# EAGLE design schematic (EAGLE 9.5.2)
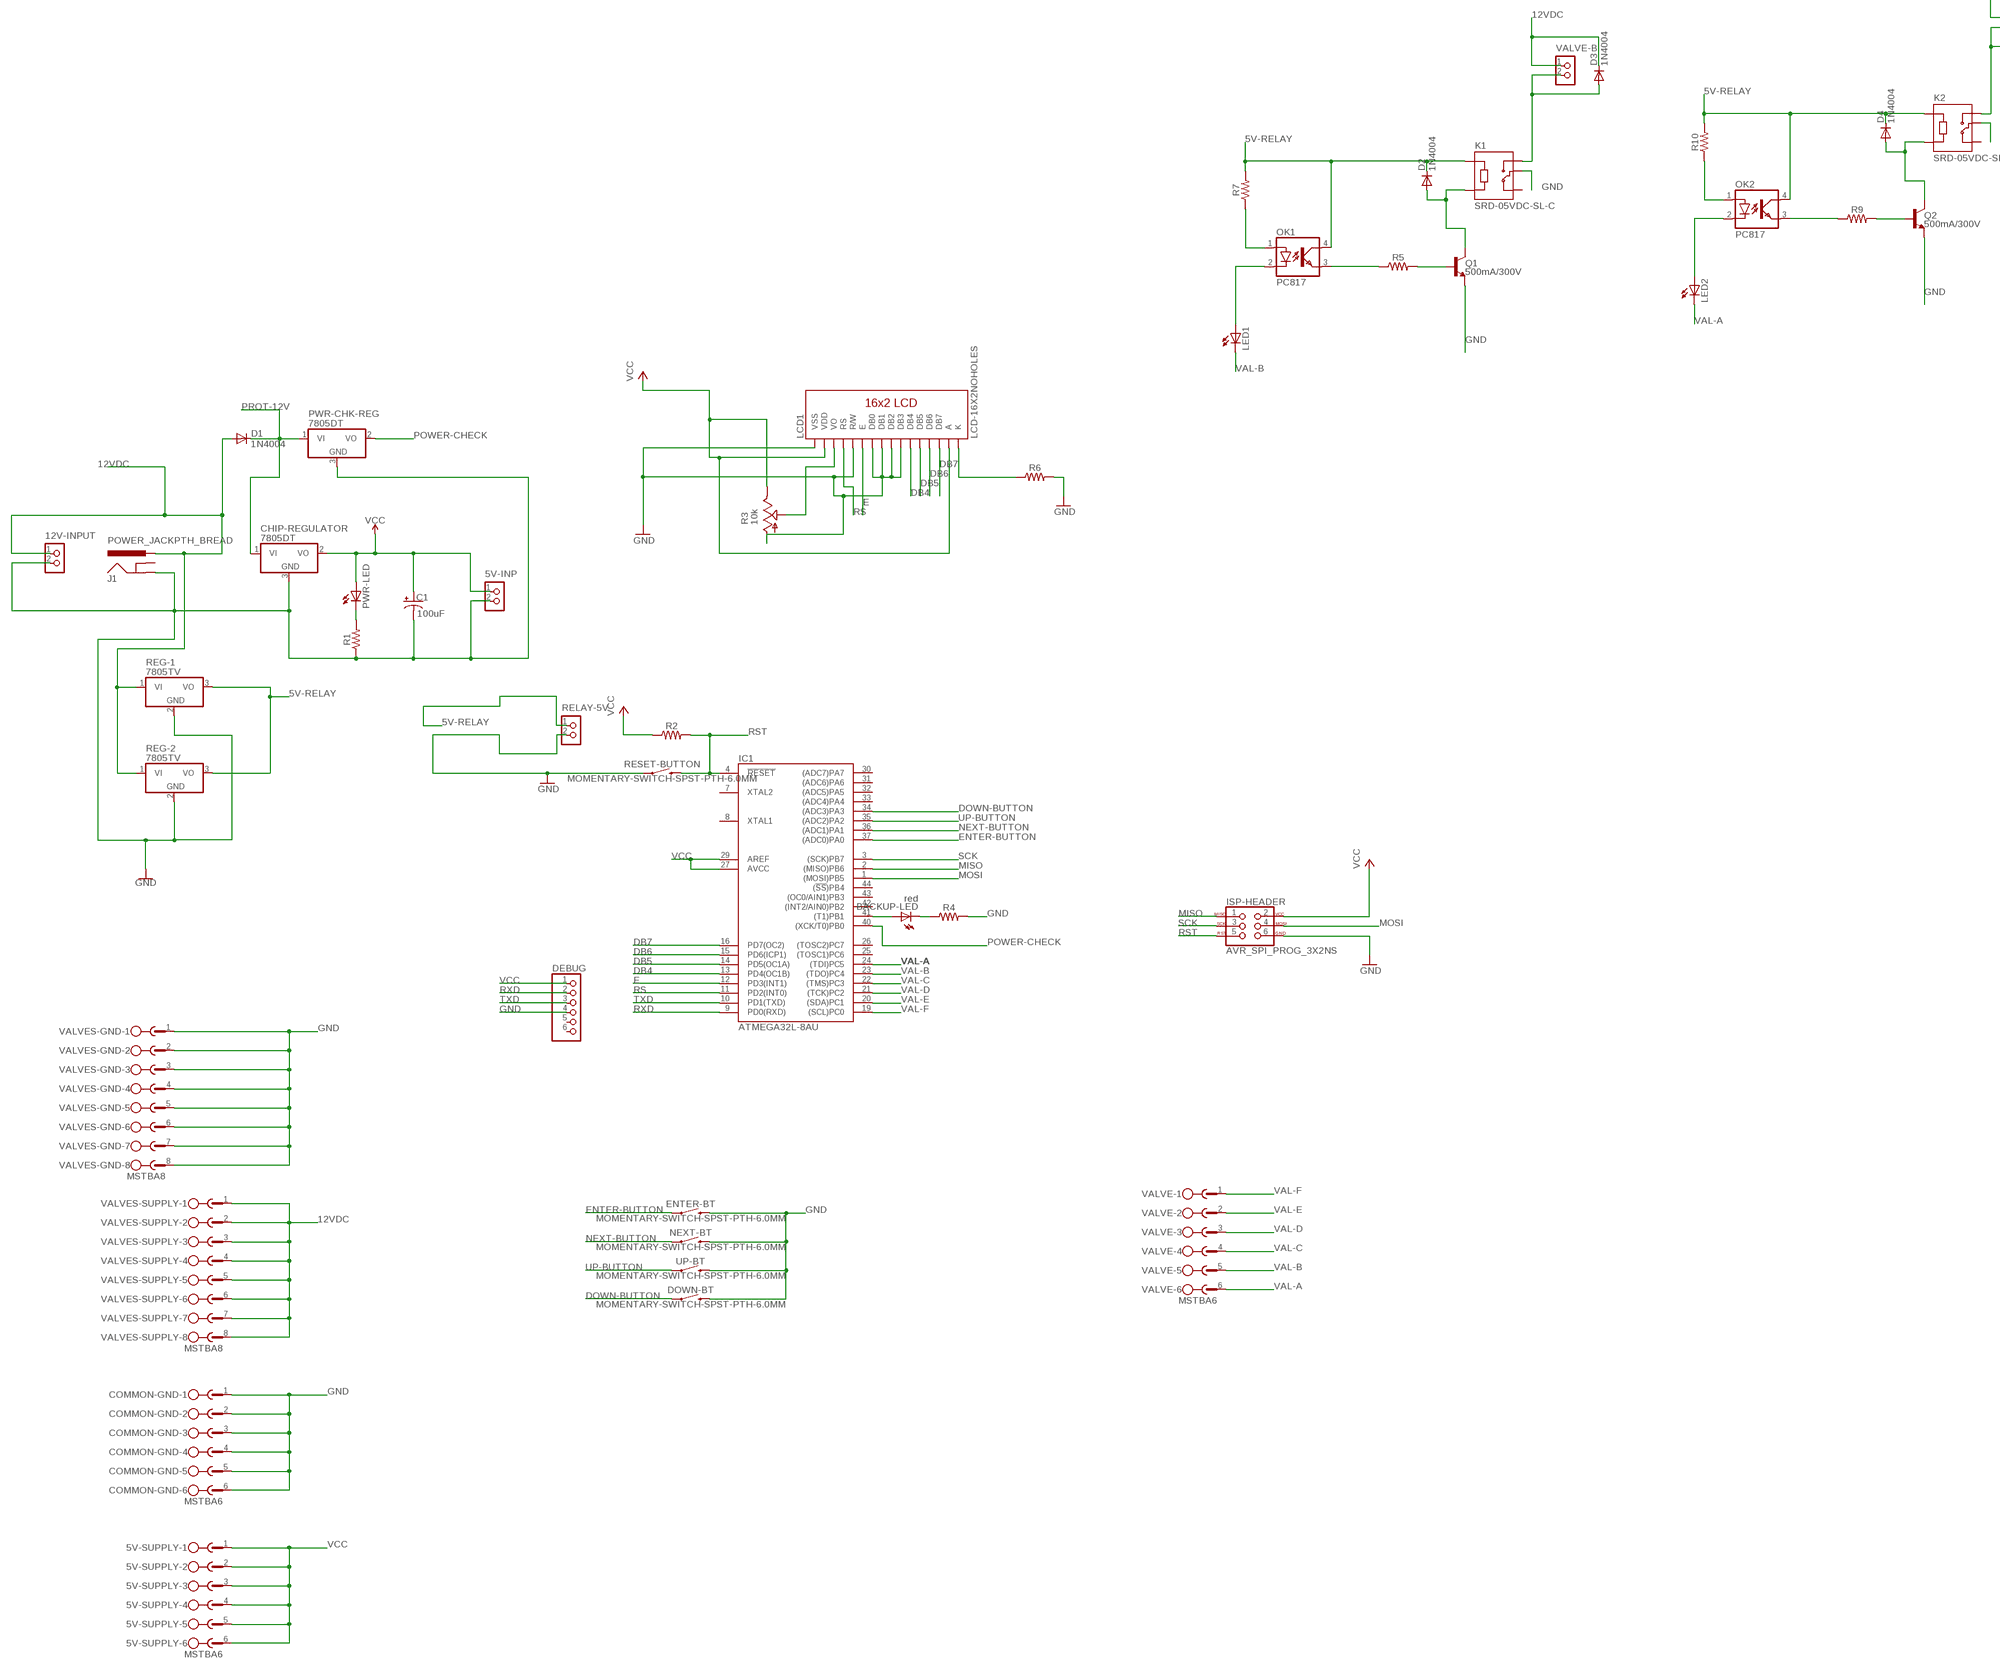
[diagram p0: schematic, sheet 1, part 1 of 2]
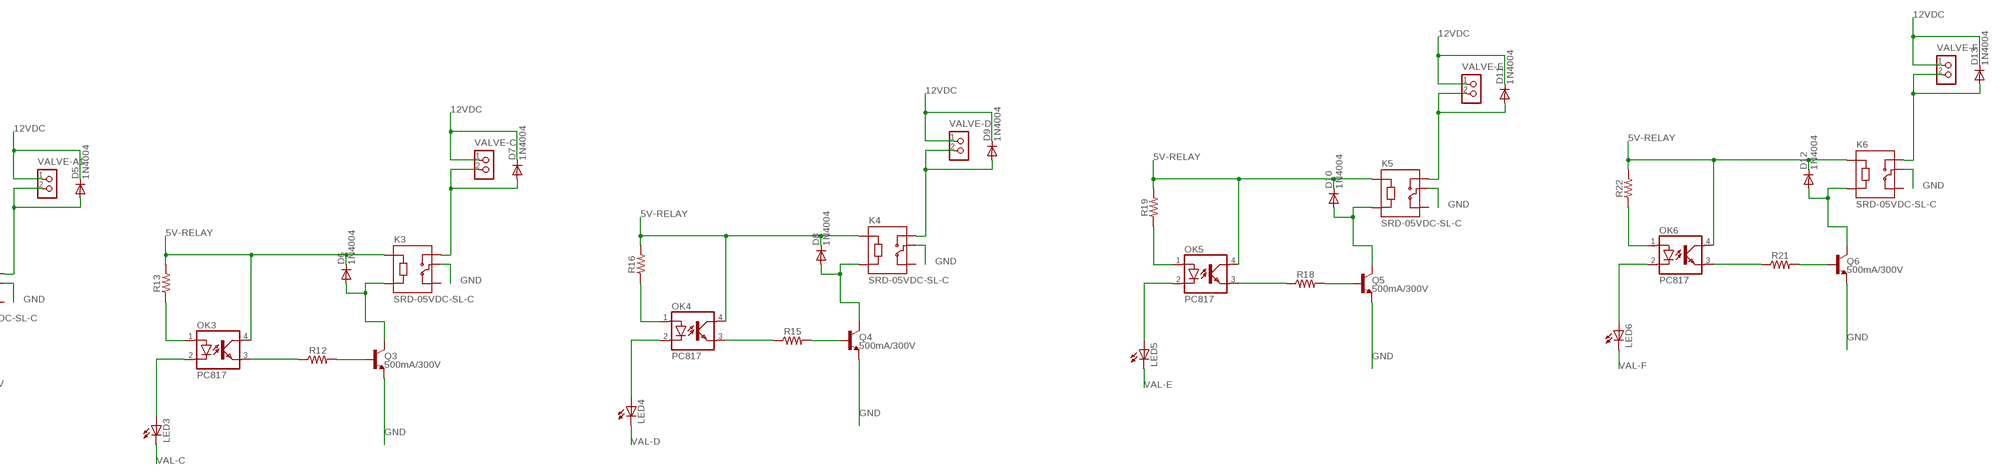
[diagram p1: schematic, sheet 1, part 2 of 2]

## Parts
5V-INP  CON_TERMINAL_BLOCK_02-5MM  [TERMINAL_BLOCK_2P_5]
5V-SUPPLY  MSTBA6  [MSTBA6]
12V-INPUT  CON_TERMINAL_BLOCK_02-5MM  [TERMINAL_BLOCK_2P_5]
BACKUP-LED  red  LED1206  [LED-1206]
C1  100uF  100UF-POLAR-RADIAL-2.5MM-25V-20%  [CPOL-RADIAL-2.5MM-6.5MM]
CHIP-REGULATOR  7805DT  [TO252]
COMMON-GND  MSTBA6  [MSTBA6]
D1  1N4004  [DO41-10]
D2  1N4004  [DO41-10]
D3  1N4004  [DO41-10]
D4  1N4004  [DO41-10]
D5  1N4004  [DO41-10]
D6  1N4004  [DO41-10]
D7  1N4004  [DO41-10]
D8  1N4004  [DO41-10]
D9  1N4004  [DO41-10]
D10  1N4004  [DO41-10]
D11  1N4004  [DO41-10]
D12  1N4004  [DO41-10]
D13  1N4004  [DO41-10]
DEBUG  PINHD-1X6B  [1X06-BIG]
DOWN-BT  MOMENTARY-SWITCH-SPST-PTH-6.0MM  [TACTILE_SWITCH_PTH_6.0MM]
ENTER-BT  MOMENTARY-SWITCH-SPST-PTH-6.0MM  [TACTILE_SWITCH_PTH_6.0MM]
IC1  ATMEGA32L-8AU  [QFP44_10X10_0.80]
ISP-HEADER  AVR_SPI_PROG_3X2NS  [2X3-NS]
J1  POWER_JACKPTH_BREAD  [POWER_JACK_PTH_BREAD]
K1  SRD-05VDC-SL-C  [RELAY_SRD-05VDC-SL-C]
K2  SRD-05VDC-SL-C  [RELAY_SRD-05VDC-SL-C]
K3  SRD-05VDC-SL-C  [RELAY_SRD-05VDC-SL-C]
K4  SRD-05VDC-SL-C  [RELAY_SRD-05VDC-SL-C]
K5  SRD-05VDC-SL-C  [RELAY_SRD-05VDC-SL-C]
K6  SRD-05VDC-SL-C  [RELAY_SRD-05VDC-SL-C]
LCD1  LCD-16X2NOHOLES  [LCD-16X2_NOHOLESNOSILK]
LED1  LED1206  [LED-1206]
LED2  LED1206  [LED-1206]
LED3  LED1206  [LED-1206]
LED4  LED1206  [LED-1206]
LED5  LED1206  [LED-1206]
LED6  LED1206  [LED-1206]
NEXT-BT  MOMENTARY-SWITCH-SPST-PTH-6.0MM  [TACTILE_SWITCH_PTH_6.0MM]
OK1  PC817  [DIL04]
OK2  PC817  [DIL04]
OK3  PC817  [DIL04]
OK4  PC817  [DIL04]
OK5  PC817  [DIL04]
OK6  PC817  [DIL04]
PWR-CHK-REG  7805DT  [TO252]
PWR-LED  LED1206  [LED-1206]
Q1  500mA/300V  TRANS_NPN-MMBTA42  [SOT23-3]
Q2  500mA/300V  TRANS_NPN-MMBTA42  [SOT23-3]
Q3  500mA/300V  TRANS_NPN-MMBTA42  [SOT23-3]
Q4  500mA/300V  TRANS_NPN-MMBTA42  [SOT23-3]
Q5  500mA/300V  TRANS_NPN-MMBTA42  [SOT23-3]
Q6  500mA/300V  TRANS_NPN-MMBTA42  [SOT23-3]
R1  RESISTOR1206  [1206]
R2  RESISTOR1206  [1206]
R3  10k  TRIM_US-CA6V  [CA6V]
R4  RESISTOR1206  [1206]
R5  RESISTOR1206  [1206]
R6  RESISTOR1206  [1206]
R7  RESISTOR1206  [1206]
R9  RESISTOR1206  [1206]
R10  RESISTOR1206  [1206]
R12  RESISTOR1206  [1206]
R13  RESISTOR1206  [1206]
R15  RESISTOR1206  [1206]
R16  RESISTOR1206  [1206]
R18  RESISTOR1206  [1206]
R19  RESISTOR1206  [1206]
R21  RESISTOR1206  [1206]
R22  RESISTOR1206  [1206]
REG-1  7805TV  [TO220V]
REG-2  7805TV  [TO220V]
RELAY-5V  CON_TERMINAL_BLOCK_02-5MM  [TERMINAL_BLOCK_2P_5]
RESET-BUTTON  MOMENTARY-SWITCH-SPST-PTH-6.0MM  [TACTILE_SWITCH_PTH_6.0MM]
UP-BT  MOMENTARY-SWITCH-SPST-PTH-6.0MM  [TACTILE_SWITCH_PTH_6.0MM]
VALVE  MSTBA6  [MSTBA6]
VALVE-A1  CON_TERMINAL_BLOCK_02-5MM  [TERMINAL_BLOCK_2P_5]
VALVE-B  CON_TERMINAL_BLOCK_02-5MM  [TERMINAL_BLOCK_2P_5]
VALVE-C  CON_TERMINAL_BLOCK_02-5MM  [TERMINAL_BLOCK_2P_5]
VALVE-D  CON_TERMINAL_BLOCK_02-5MM  [TERMINAL_BLOCK_2P_5]
VALVE-E  CON_TERMINAL_BLOCK_02-5MM  [TERMINAL_BLOCK_2P_5]
VALVE-F  CON_TERMINAL_BLOCK_02-5MM  [TERMINAL_BLOCK_2P_5]
VALVES-GND  MSTBA8  [MSTBA8]
VALVES-SUPPLY  MSTBA8  [MSTBA8]

## Nets
5V-RELAY: D2.C D4.C D6.C D8.C D10.C D12.C K1.A1 K2.A1 K3.A1 K4.A1 K5.A1 K6.A1 OK1.4(COL) OK2.4(COL) OK3.4(COL) OK4.4(COL) OK5.4(COL) OK6.4(COL) R7.2 R10.2 R13.2 R16.2 R19.2 R22.2 REG-1.3(VO) REG-2.3(VO) RELAY-5V.1
12VDC: 12V-INPUT.1 D1.A D3.C D5.C D7.C D9.C D11.C D13.C J1.PWR REG-1.1(VI) REG-2.1(VI) VALVE-A1.1 VALVE-B.1 VALVE-C.1 VALVE-D.1 VALVE-E.1 VALVE-F.1 VALVES-SUPPLY.1 VALVES-SUPPLY.2 VALVES-SUPPLY.3 VALVES-SUPPLY.4 VALVES-SUPPLY.5 VALVES-SUPPLY.6 VALVES-SUPPLY.7 VALVES-SUPPLY.8
DB4: IC1.13(PD4(OC1B)) LCD1.11(DB4)
DB5: IC1.14(PD5(OC1A)) LCD1.12(DB5)
DB6: IC1.15(PD6(ICP1)) LCD1.13(DB6)
DB7: IC1.16(PD7(OC2)) LCD1.14(DB7)
DOWN-BUTTON: DOWN-BT.1 IC1.34((ADC3)PA3)
E: IC1.12(PD3(INT1)) LCD1.6(E)
ENTER-BUTTON: ENTER-BT.1 IC1.37((ADC0)PA0)
GND: 5V-INP.2 12V-INPUT.2 C1.2(-) CHIP-REGULATOR.3(GND) COMMON-GND.1 COMMON-GND.2 COMMON-GND.3 COMMON-GND.4 COMMON-GND.5 COMMON-GND.6 DEBUG.4 DOWN-BT.3 ENTER-BT.3 ISP-HEADER.6 J1.GND K1.COM K2.COM K3.COM K4.COM K5.COM K6.COM LCD1.1(VSS) LCD1.5(R/W) LCD1.7(DB0) LCD1.8(DB1) LCD1.9(DB2) LCD1.10(DB3) NEXT-BT.3 PWR-CHK-REG.3(GND) Q1.2(E) Q2.2(E) Q3.2(E) Q4.2(E) Q5.2(E) Q6.2(E) R1.1 R3.A R4.2 R6.2 REG-1.2(GND) REG-2.2(GND) RELAY-5V.2 RESET-BUTTON.1 UP-BT.3 VALVES-GND.1 VALVES-GND.2 VALVES-GND.3 VALVES-GND.4 VALVES-GND.5 VALVES-GND.6 VALVES-GND.7 VALVES-GND.8
MISO: IC1.2((MISO)PB6) ISP-HEADER.1
MOSI: IC1.1((MOSI)PB5) ISP-HEADER.4
N$1: LCD1.16(K) R6.1
N$2: PWR-LED.C R1.2
N$3: OK1.1(A) R7.1
N$4: BACKUP-LED.A IC1.41((T1)PB1)
N$5: BACKUP-LED.C R4.1
N$6: LCD1.3(VO) R3.S
N$7: LED1.A OK1.2(C)
N$8: OK1.3(EMIT) R5.1
N$9: D2.A K1.A2 Q1.3(C)
N$10: Q1.1(B) R5.2
N$11: OK2.1(A) R10.1
N$12: D3.A K1.NO VALVE-B.2
N$13: LED2.A OK2.2(C)
N$14: OK2.3(EMIT) R9.1
N$15: Q2.1(B) R9.2
N$16: D4.A K2.A2 Q2.3(C)
N$17: D5.A K2.NO VALVE-A1.2
N$18: OK3.1(A) R13.1
N$19: LED3.A OK3.2(C)
N$20: OK3.3(EMIT) R12.1
N$21: Q3.1(B) R12.2
N$22: D6.A K3.A2 Q3.3(C)
N$23: D7.A K3.NO VALVE-C.2
N$24: OK4.1(A) R16.1
N$25: LED4.A OK4.2(C)
N$26: OK4.3(EMIT) R15.1
N$27: Q4.1(B) R15.2
N$28: D8.A K4.A2 Q4.3(C)
N$29: D9.A K4.NO VALVE-D.2
N$30: OK5.1(A) R19.1
N$31: LED5.A OK5.2(C)
N$32: OK5.3(EMIT) R18.1
N$33: Q5.1(B) R18.2
N$34: D10.A K5.A2 Q5.3(C)
N$35: D11.A K5.NO VALVE-E.2
N$36: OK6.1(A) R22.1
N$37: LED6.A OK6.2(C)
N$38: OK6.3(EMIT) R21.1
N$39: Q6.1(B) R21.2
N$40: D12.A K6.A2 Q6.3(C)
N$41: D13.A K6.NO VALVE-F.2
NEXT-BUTTON: IC1.36((ADC1)PA1) NEXT-BT.1
POWER-CHECK: IC1.40((XCK/T0)PB0) PWR-CHK-REG.2(VO)
PROT-12V: CHIP-REGULATOR.1(VI) D1.C PWR-CHK-REG.1(VI)
RS: IC1.11(PD2(INT0)) LCD1.4(RS)
RST: IC1.4(!RESET) ISP-HEADER.5 R2.2 RESET-BUTTON.3
RXD: DEBUG.2 IC1.9(PD0(RXD))
SCK: IC1.3((SCK)PB7) ISP-HEADER.3
TXD: DEBUG.3 IC1.10(PD1(TXD))
UP-BUTTON: IC1.35((ADC2)PA2) UP-BT.1
VAL-A: IC1.24((TDI)PC5) LED2.C VALVE.6
VAL-B: IC1.23((TDO)PC4) LED1.C VALVE.5
VAL-C: IC1.22((TMS)PC3) LED3.C VALVE.4
VAL-D: IC1.21((TCK)PC2) LED4.C VALVE.3
VAL-E: IC1.20((SDA)PC1) LED5.C VALVE.2
VAL-F: IC1.19((SCL)PC0) LED6.C VALVE.1
VCC: 5V-INP.1 5V-SUPPLY.1 5V-SUPPLY.2 5V-SUPPLY.3 5V-SUPPLY.4 5V-SUPPLY.5 5V-SUPPLY.6 C1.1(+) CHIP-REGULATOR.2(VO) DEBUG.1 IC1.27(AVCC) IC1.29(AREF) ISP-HEADER.2 LCD1.2(VDD) LCD1.15(A) PWR-LED.A R2.1 R3.E
Unconnected: DEBUG.5 DEBUG.6 IC1.7(XTAL2) IC1.8(XTAL1) IC1.25((TOSC1)PC6) IC1.26((TOSC2)PC7) IC1.30((ADC7)PA7) IC1.31((ADC6)PA6) IC1.32((ADC5)PA5) IC1.33((ADC4)PA4) IC1.42((INT2/AIN0)PB2) IC1.43((OC0/AIN1)PB3) IC1.44((!SS!)PB4) J1.GNDBREAK K1.NC K2.NC K3.NC K4.NC K5.NC K6.NC

## Power pins joined to a net without a drawn wire
GND: IC1.6(GND) IC1.18(GND) IC1.28(GND) IC1.39(GND)
VCC: IC1.5(VCC) IC1.17(VCC) IC1.38(VCC)

## Library data of the parts
5V-INP 12V-INPUT RELAY-5V VALVE-A1 VALVE-B VALVE-C VALVE-D VALVE-E VALVE-F = dp_devices:CON_TERMINAL_BLOCK_02: 2 poles wire to board terminal block
5V-SUPPLY COMMON-GND VALVE = con-phoenix-508:MSTBA6: PHOENIX; MF: FARNELL; MPN: 1757284; OC_FARNELL: 3705213; OC_NEWARK: 71C4165
BACKUP-LED LED1-LED6 PWR-LED = SparkFun-Retired:LED: LEDs Standard schematic elements and footprints for 5mm, 3mm, 1206, and 0603 sized LEDs. 5mm - Spark Fun Electronics SKU : Comp-SBL
C1 = SparkFun-Capacitors:100UF-POLAR: 100µF polarized capacitors A capacitor is a passive two-terminal electrical component used to store electrical energy temporarily in an electric field.; PROD_ID: CAP-08439
CHIP-REGULATOR REG-1 REG-2 = linear:78*: Positive VOLTAGE REGULATOR Source: http://cache.national.com/ds/LM/LM78L05.pdf http://www.fairchildsemi.com/ds/LM/LM7805.pdf
D1-D13 = adafruit:1N4004: DIODE General purpose 1N400x type rectifier (With bigger pads) http://www.ladyada.net/library/pcb/eaglelibrary.html
DEBUG = adafruit:PINHD-1X6: PIN HEADER
DOWN-BT ENTER-BT NEXT-BT RESET-BUTTON UP-BT = SparkFun-Switches:MOMENTARY-SWITCH-SPST: Momentary Switch (Pushbutton) - SPST Normally-open (NO) SPST momentary switches (buttons, pushbuttons). Variants PTH-12MM - 12mm square, through-hole Momentary Pushbutton Switch - 12mm Square <https://www.sparkfun.com/products/9190> (COM-09190) PTH-6.0MM, PTH-6.0MM-KIT - 6.0mm square, through-hole Mini Pushbutton Switch <https://www.sparkfun.com/products/97> (COM-00097) KIT package intended for soldering kit's - only one side of pads' copper is exposed. PTH-RIGHT-ANGLE-KIT - Right-angle, through-hole Right Angle Tactile Button <https://www.sparkfun.com/products/10791> - Used on SparkFun BigTime Watch Kit <https://www.sparkfun.com/products/11734> SMD-12MM - 12mm square, surface-mount Tactile Button - SMD (12mm) <https://www.sparkfun.com/products/12993> (COM-12993) Used on SparkFun PicoBoard <https://www.sparkfun.com/products/11888> SMD-4.5MM - 4.5mm Square Trackball Switch Used on SparkFun Blackberry Trackballer Breakout <https://www.sparkfun.com/products/13169> SMD-4.6MMX2.8MM - 4.60mm x 2.80mm, surface mount Used on SparkFun SAMD21 Mini Breakout <https://www.sparkfun.com/products/13664> SMD-5.2MM, SMD-5.2-REDUNDANT - 5.2mm square, surface-mount Mini Pushbutton Switch - SMD <https://www.sparkfun.com/products/8720> (COM-08720) Used on Arduino Pro Mini <https://www.sparkfun.com/products/11114> REDUNDANT package connects both switch circuits together SMD-6.0X3.5MM - 6.0 x 3.5mm, surface mount Momentary Reset Switch SMD <https://www.sparkfun.com/products/8229> (COM-08229) SMD-6.2MM-TALL - 6.2mm square, surface mount Tactile Button - SMD (6mm) <https://www.sparkfun.com/products/12992> Used on SparkFun Digital Sandbox <https://www.sparkfun.com/products/12651> SMD-RIGHT-ANGLE - Right-angle, surface mount Used on SparkFun Block for Intel® Edison - Arduino <https://www.sparkfun.com/products/13036>; PROD_ID: SWCH-08441; SF_SKU: COM-00097
IC1 = atmel:ATMEGA32: 8-bit AVR Microcontroller 32 Kbytes FLASH 2 Kbytes SRAM 1 Kbytes EEPROM USART 8-channel 10 bit ADC
ISP-HEADER = SparkFun-Connectors:AVR_SPI_PROG_3X2: AVR ISP 6 Pin This is the reduced ISP connector for AVR programming. Common on Arduino. This footprint will take up less PCB space and can be used with a 10-pin to 6-pin adapter such as SKU: BOB-08508 **Special note about "TEST_POINT" package. The stop mask is on the top side, so if you want your programming test points to be on the bottom of your board, make sure to place this package on the bottom side of the board. This also ensure that the orientation to program from the bottom side will be correct. SparkFun Products: SparkFun ISP Pogo Adapter <https://www.sparkfun.com/products/11591> - NS Tiny AVR Programmer <https://www.sparkfun.com/products/11801> -PTH
J1 = SparkFun-Connectors:POWER_JACK: Power Jack Connector This is the standard 5.5mm barrel jack for power. The PTH is the most common, proven, reliable, footprint. The Slot footprint only works if the mill layer is transmitted to the PCB fab house so be warned. Here are the connectors we sell at SparkFun: DC Barrel Power Jack/Connector <https://www.sparkfun.com/products/119> (PRT-00119) DC Barrel Power Jack/Connector (SMD) <https://www.sparkfun.com/products/12748> (PRT-12748) DC Barrel Jack Adapter - Breadboard Compatible <https://www.sparkfun.com/products/10811> (PRT-10811) It is used on this SparkFun product (and many, many others): SparkFun RedBoard - Programmed with Arduino <https://www.sparkfun.com/products/12757> (DEV-12757) Also, if you need a mating power supply or connector, please check these out: Wall Adapter Power Supply - 9VDC 650mA <https://www.sparkfun.com/products/298> (TOL-00298) DC Barrel Jack Adapter - Male <https://www.sparkfun.com/products/10287> (PRT-10287); PROD_ID: PRT-10811
K1-K5 = SRD-05VDC-SL-C:SRD-05VDC-SL-C: 5V Trigger Relay Module For Arduino And Raspberry Pi 5V Trigger Relay Module For Arduino And Raspberry Pi; AVAILABILITY: Unavailable; DESCRIPTION: 5V Trigger Relay Module For Arduino And Raspberry Pi 5V Trigger Relay Module For Arduino And Raspberry Pi; MF: Songle Relay; MP: SRD-05VDC-SL-C; PACKAGE: None; PRICE: None
K6 = SRD-05VDC-SL-C:SRD-05VDC-SL-C: 5V Trigger Relay Module For Arduino And Raspberry Pi 5V Trigger Relay Module For Arduino And Raspberry Pi; AVAILABILITY: Unavailable; DESCRIPTION: 5V Trigger Relay Module For Arduino And Raspberry Pi 5V Trigger Relay Module For Arduino And Raspberry Pi; MF: Songle Relay; MP: SRD-05VDC-SL-C; PACKAGE: None; PRICE: None; SPICEPREFIX: X
LCD1 = SparkFun-Displays:LCD-16X2: Standard text-only 16x2 parallel input LCD Basic 16 character by 2 line display. Typically utilizes the extremely common HD44780 parallel interface chipset SparkFun Products: Basic 16x2 Green <https://www.sparkfun.com/products/255> Basic 8x2 Green <https://www.sparkfun.com/products/11122>; SF_ID: LCD-00255
OK1 OK3-OK6 = optocoupler:PC817: SHARP OPTO COUPLER; MPN: PC817X4J000F; OC_FARNELL: 9707727; OC_NEWARK: 97K7059
OK2 = optocoupler:PC817: SHARP OPTO COUPLER; MPN: PC817X4J000F; OC_FARNELL: 9707727; OC_NEWARK: 97K7059; SPICEPREFIX: O
PWR-CHK-REG = adafruit:78*: Positive VOLTAGE REGULATOR Added bigger pads to the TO-92 package
Q1-Q6 = SparkFun-DiscreteSemi:TRANS_NPN: NPN transistor Current controlled devices typically used to amplify current or used as a switch. BC547 - COM-08928 <http://www.sparkfun.com/products/8928> (TO-92 45V 100mA) (1.Collector 2.Base 3.Emitter) 2N3904 - COM-00521 <http://www.sparkfun.com/products/521> (TO-92 40V 200mA) (1.Emitter 2.Base 3.Collector) P2N2222A - COM-12852 <http://www.sparkfun.com/products/12852> (TO-92 40V 600mA) (1.Collector 2.Base 3.Emitter); PROD_ID: TRANS-09116
R1 = SparkFun-Resistors:RESISTOR: Generic Resistor Package; PROD_ID: 330ohms
R2 R4-R7 R9 R10 R12 R13 R15 R16 R18 R19 R21 R22 = SparkFun-Resistors:RESISTOR: Generic Resistor Package
R3 = pot:TRIM_US-: POTENTIOMETER
VALVES-GND = con-phoenix-508:MSTBA8: PHOENIX; MF: FARNELL; MPN: 1757307; OC_FARNELL: 3705225; OC_NEWARK: 71C4166
VALVES-SUPPLY = con-phoenix-508:MSTBA8: PHOENIX; MF: FARNELL; MPN: 1757307; OC_FARNELL: 3705225; OC_NEWARK: 71C4166; SPICEPREFIX: X

## Board
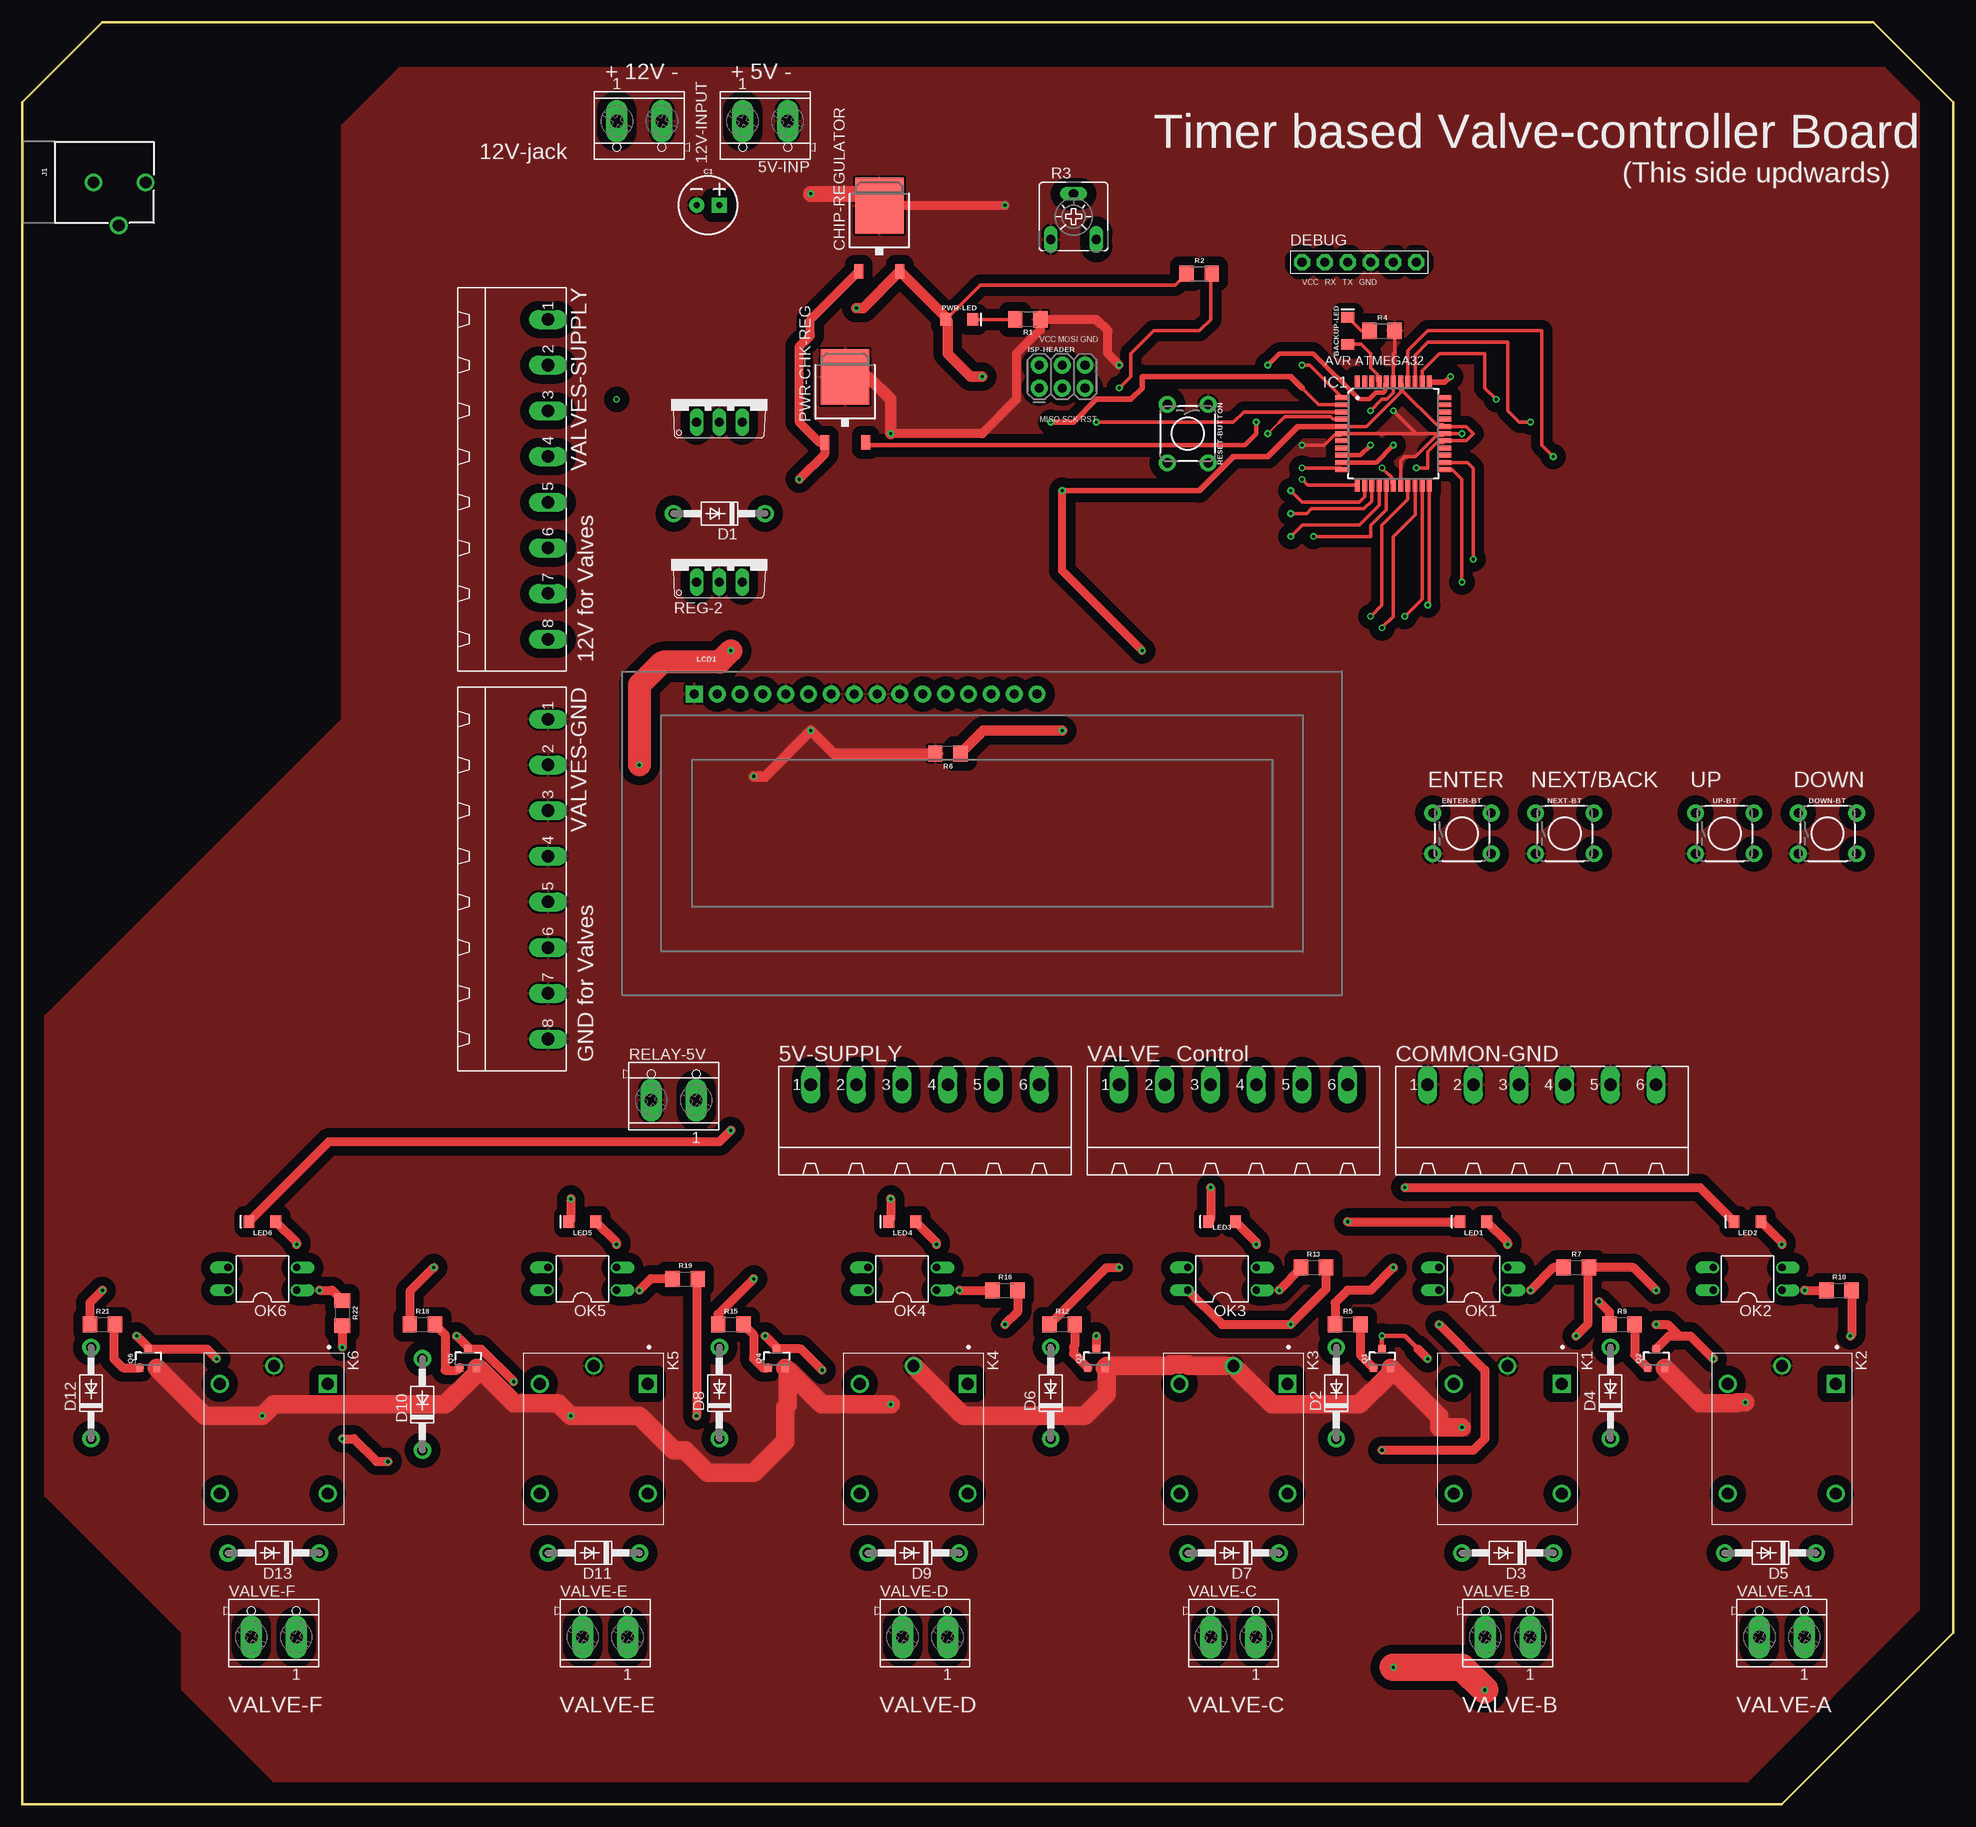
[diagram p2: board, top side]
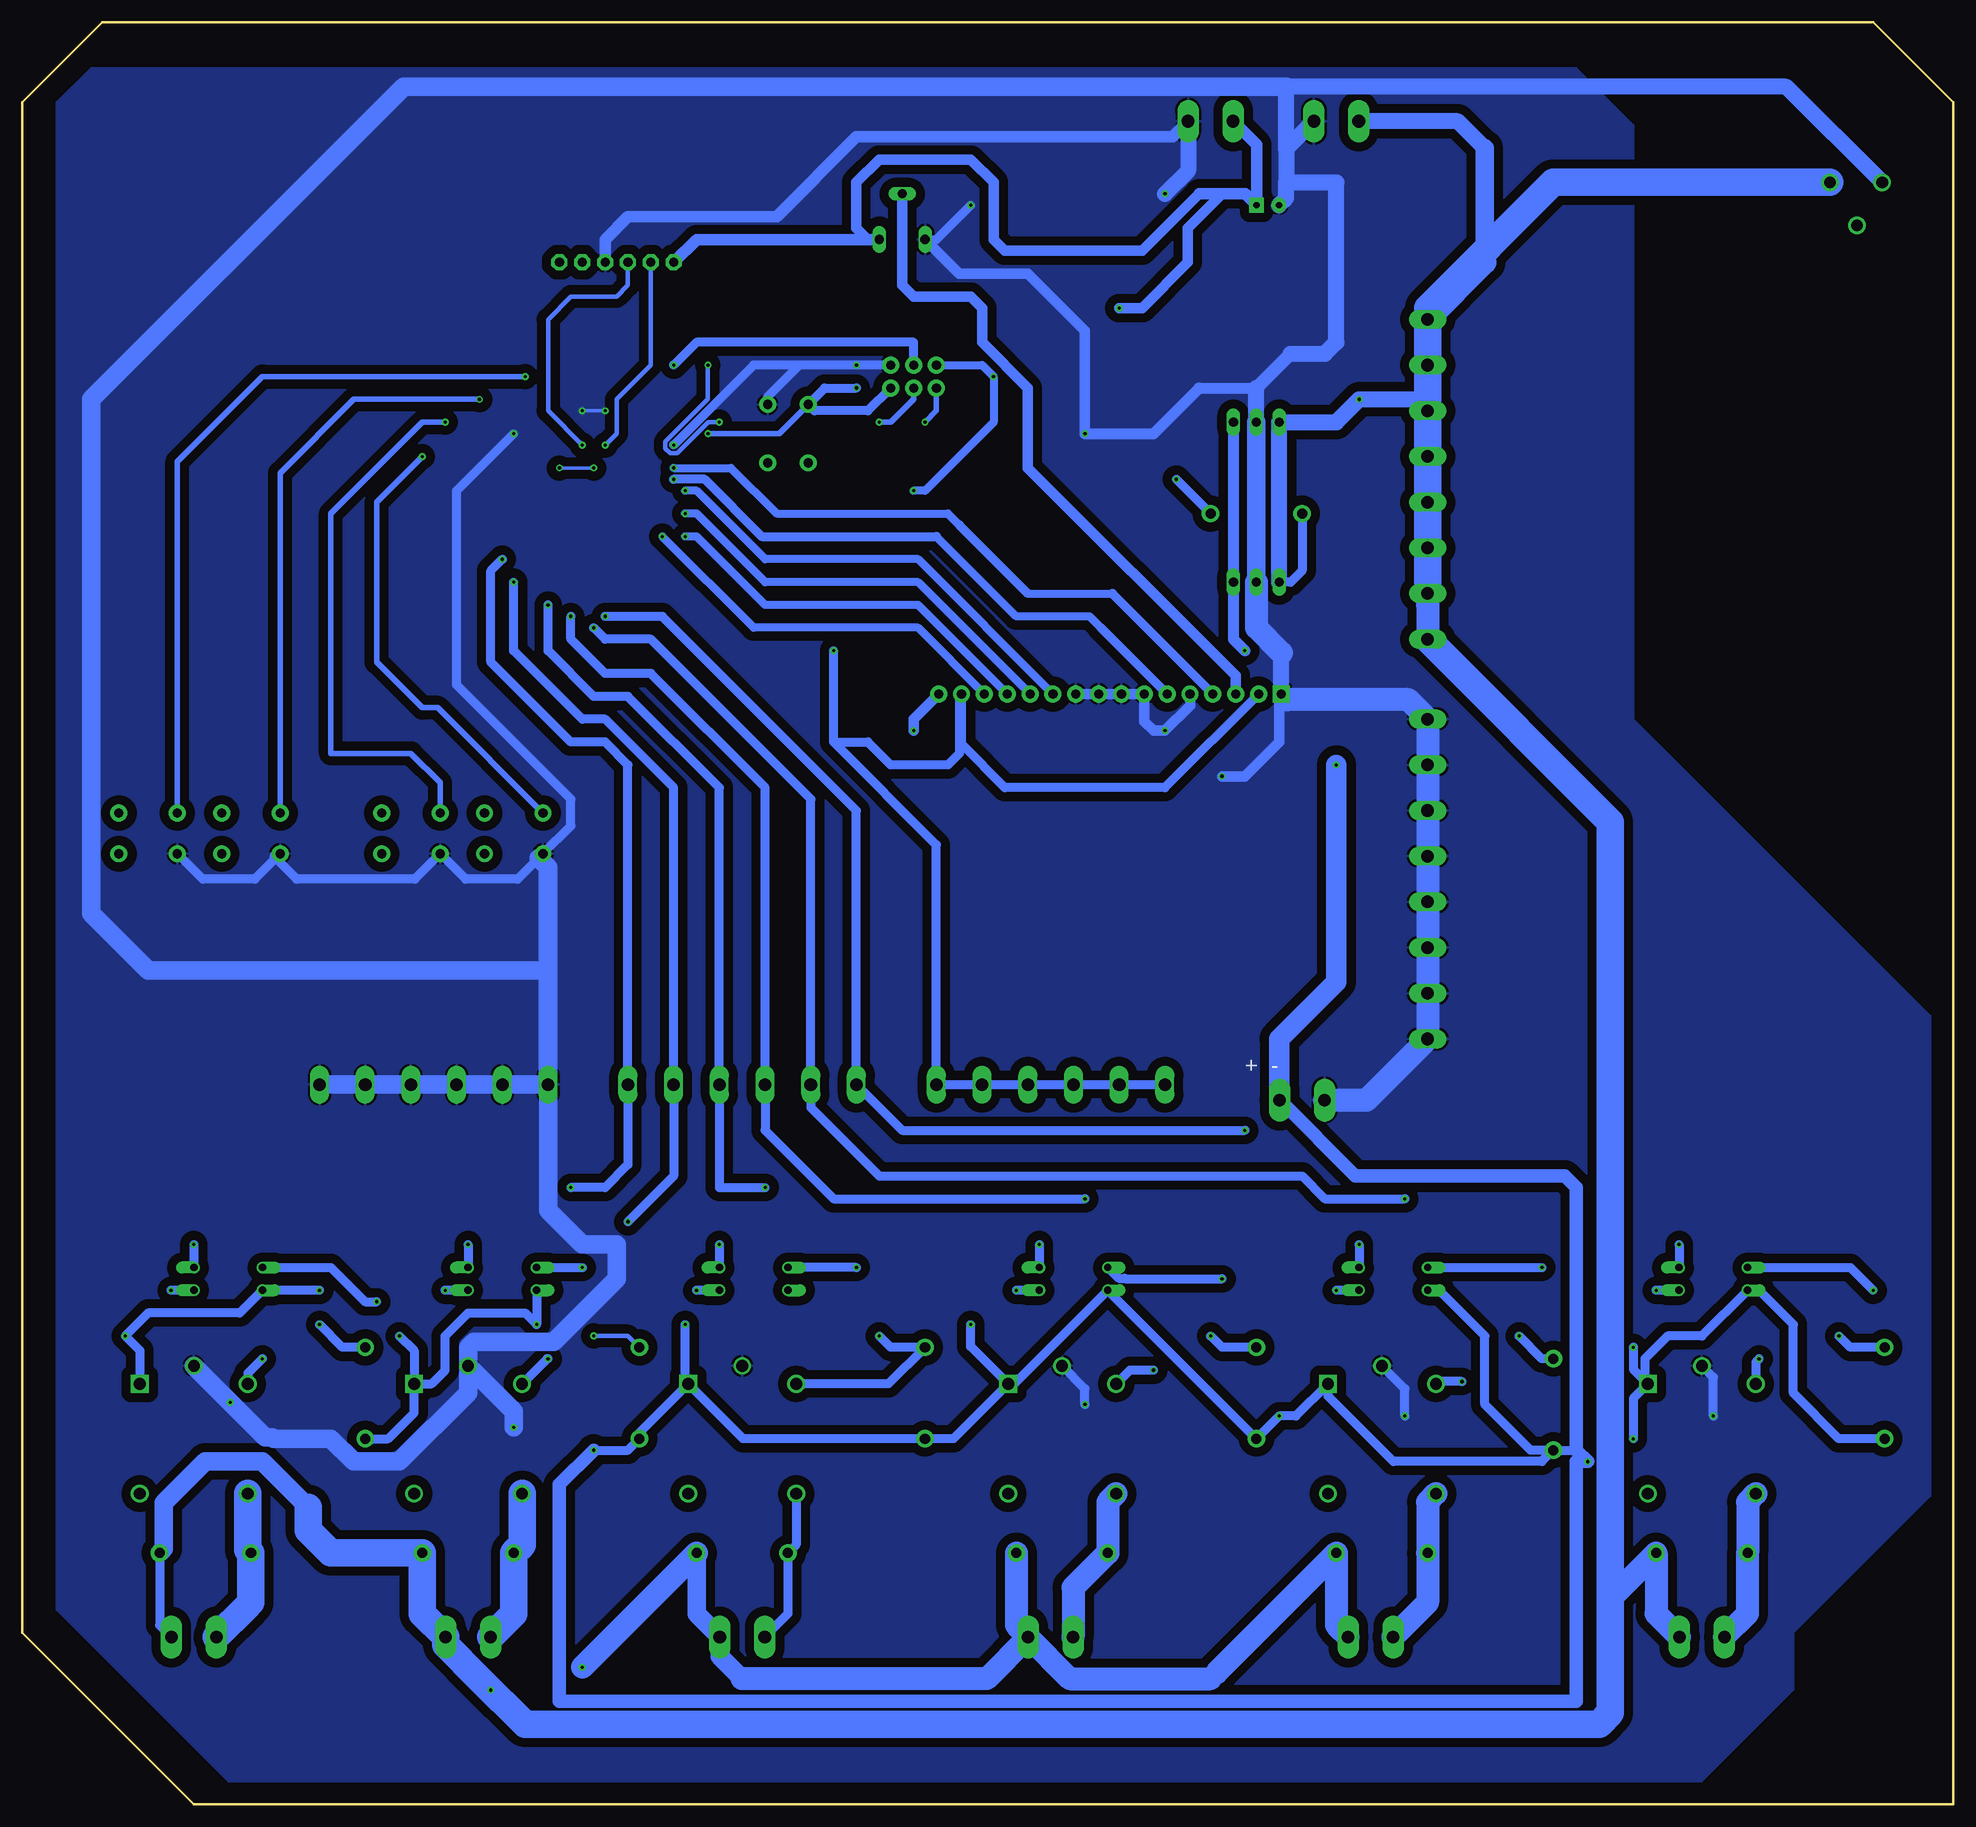
[diagram p3: board, bottom side, seen from below]

Size 214.63 x 198.12 mm. Coordinates in mm from the lower left corner, seen from the top.
Outline: 205.74,198.12 214.63,189.23 214.63,19.05 195.58,0 0,0 0,189.23 8.89,198.12 205.74,198.12
Copper layers (1*16): Top 0.035mm / dielectric 1.5mm / Bottom 0.035mm
Design rules "default": minimum track width 6mil, minimum drill 0.35mm, track to track 6mil, track to pad 6mil, pad to pad 6mil, via to via 6mil, smd to smd 6mil, copper to edge 40mil, drill to drill 6mil, minimum pad ring 10mil, minimum via ring 8mil, stop-mask expansion 4mil, vias tented up to drill 0mil, thermal gap 10mil

### Footprints (pad centres in the part's own frame; a part is rotated, then mirrored left to right if it is on the bottom)
TERMINAL_BLOCK_2P_5 = drill 1.4 pad 2.38 long: 1 2.5,-0.45; 2 -2.5,-0.45
MSTBA6 = drill 1.397 long: 1 -12.7,5.08; 2 -7.62,5.08; 3 -2.54,5.08; 4 2.54,5.08; 5 7.62,5.08; 6 12.7,5.08
LED-1206 = smd 1.2 x 1.4: A -1.5,0; C 1.5,0
CPOL-RADIAL-2.5MM-6.5MM = drill 0.7 pad 1.651 square: 1 1.25,0 | drill 0.7 pad 1.651: 2 -1.25,0
TO252 = smd 1 x 1.6: 1 -2.28,-4.8; 2 2.28,-4.8 | smd 5.4 x 6.2: 3 0,2.5
DO41-10 = drill 1.118 pad 1.93: A 5.08,0; C -5.08,0
1X06-BIG = drill 1.016 pad 1.778 octagon: 1 -6.35,0; 2 -3.81,0; 3 -1.27,0; 4 1.27,0; 5 3.81,0; 6 6.35,0
TACTILE_SWITCH_PTH_6.0MM = drill 1.016 pad 1.88: 1 -3.251,2.261; 2 3.251,2.261; 3 -3.251,-2.261; 4 3.251,-2.261
QFP44_10X10_0.80 = smd 1.5 x 0.55: 1 -5.7,4; 2 -5.7,3.2; 3 -5.7,2.4; 4 -5.7,1.6; 5 -5.7,0.8; 6 -5.7,0; 7 -5.7,-0.8; 8 -5.7,-1.6; 9 -5.7,-2.4; 10 -5.7,-3.2; 11 -5.7,-4; 23 5.7,-4; 24 5.7,-3.2; 25 5.7,-2.4; 26 5.7,-1.6; 27 5.7,-0.8; 28 5.7,0; 29 5.7,0.8; 30 5.7,1.6; 31 5.7,2.4; 32 5.7,3.2; 33 5.7,4 | smd 0.55 x 1.5: 12 -4,-5.7; 13 -3.2,-5.7; 14 -2.4,-5.7; 15 -1.6,-5.7; 16 -0.8,-5.7; 17 0,-5.7; 18 0.8,-5.7; 19 1.6,-5.7; 20 2.4,-5.7; 21 3.2,-5.7; 22 4,-5.7; 34 4,5.7; 35 3.2,5.7; 36 2.4,5.7; 37 1.6,5.7; 38 0.8,5.7; 39 0,5.7; 40 -0.8,5.7; 41 -1.6,5.7; 42 -2.4,5.7; 43 -3.2,5.7; 44 -4,5.7
2X3-NS = drill 1.016 pad 1.88: 1 -2.54,-1.27; 2 -2.54,1.27; 3 0,-1.27; 4 0,1.27; 5 2.54,-1.27; 6 2.54,1.27
POWER_JACK_PTH_BREAD = drill 1.3: GND 0,7.9; GNDBREAK 4.8,10.7; PWR 0,13.7
RELAY_SRD-05VDC-SL-C = drill 1.32 square: A1 -6.1,6 | drill 1.32: A2 -6.1,-6; NC 6.1,6; NO 6.1,-6 | drill 1.29: COM -8.1,0
LCD-16X2_NOHOLESNOSILK = drill 1.016 pad 1.88 square: 1 -32,15.5 | drill 1.016 pad 1.88: 2 -29.46,15.5; 3 -26.92,15.5; 4 -24.38,15.5; 5 -21.84,15.5; 6 -19.3,15.5; 7 -16.76,15.5; 8 -14.22,15.5; 9 -11.68,15.5; 10 -9.14,15.5; 11 -6.6,15.5; 12 -4.06,15.5; 13 -1.52,15.5; 14 1.02,15.5; 15 3.56,15.5; 16 6.1,15.5
DIL04 = drill 0.813 offset: 1 -1.27,-3.81; 2 1.27,-3.81; 3 1.27,3.81; 4 -1.27,3.81
SOT23-3 = smd 0.8 x 0.9: 1 -0.95,-1; 2 0.95,-1; 3 0,1.1
1206 = smd 1.6 x 1.8: 1 -1.4,0; 2 1.4,0
CA6V = drill 1.016 long: A -2.54,-2.54; E 2.54,-2.54; S 0,2.54
TO220V = drill 1.016 long: 1 -2.54,-2.54; 2 0,-2.54; 3 2.54,-2.54
MSTBA8 = drill 1.397 long: 1 -17.78,5.08; 2 -12.7,5.08; 3 -7.62,5.08; 4 -2.54,5.08; 5 2.54,5.08; 6 7.62,5.08; 7 12.7,5.08; 8 17.78,5.08

### Placement (x,y rotation side)
5V-INP  82.55,186.69 180 top
5V-SUPPLY  100.33,74.93 0 top
12V-INPUT  68.58,186.69 180 top
BACKUP-LED  147.32,163.83 90 top
C1  76.2,177.8 0 top
CHIP-REGULATOR  95.25,175.26 0 top
COMMON-GND  168.91,74.93 0 top
D1  77.47,143.51 180 top
D2  146.05,45.72 90 top
D3  165.1,27.94 180 top
D4  176.53,45.72 90 top
D5  194.31,27.94 180 top
D6  114.3,45.72 90 top
D7  134.62,27.94 180 top
D8  77.47,45.72 90 top
D9  99.06,27.94 180 top
D10  44.45,44.45 90 top
D11  63.5,27.94 180 top
D12  7.62,45.72 90 top
D13  27.94,27.94 180 top
DEBUG  148.59,171.45 0 top
DOWN-BT  200.66,107.95 0 top
ENTER-BT  160.02,107.95 0 top
IC1  152.4,152.4 0 top
ISP-HEADER  115.57,158.75 0 top
J1  0,180.34 270 top
K1  165.1,40.64 270 top
K2  195.58,40.64 270 top
K3  134.62,40.64 270 top
K4  99.06,40.64 270 top
K5  63.5,40.64 270 top
K6  27.94,40.64 270 top
LCD1  106.68,107.95 0 top
LED1  161.29,64.77 180 top
LED2  191.77,64.77 180 top
LED3  133.35,64.77 180 top
LED4  97.79,64.77 180 top
LED5  62.23,64.77 180 top
LED6  26.67,64.77 180 top
NEXT-BT  171.45,107.95 0 top
OK1  161.29,58.42 90 top
OK2  191.77,58.42 90 top
OK3  133.35,58.42 90 top
OK4  97.79,58.42 90 top
OK5  62.23,58.42 90 top
OK6  26.67,58.42 90 top
PWR-CHK-REG  91.44,156.21 0 top
PWR-LED  104.14,165.1 0 top
Q1  151.13,49.53 0 top
Q2  181.61,49.53 0 top
Q3  119.38,49.53 0 top
Q4  83.82,49.53 0 top
Q5  49.53,49.53 0 top
Q6  13.97,49.53 0 top
R1  111.76,165.1 180 top
R2  130.81,170.18 0 top
R3  116.84,176.53 0 top
R4  151.13,163.83 0 top
R5  147.32,53.34 0 top
R6  102.87,116.84 180 top
R7  172.72,59.69 0 top
R9  177.8,53.34 0 top
R10  201.93,57.15 0 top
R12  115.57,53.34 0 top
R13  143.51,59.69 0 top
R15  78.74,53.34 0 top
R16  109.22,57.15 0 top
R18  44.45,53.34 0 top
R19  73.66,58.42 0 top
R21  8.89,53.34 0 top
R22  35.56,54.61 270 top
REG-1  77.47,156.21 0 top
REG-2  77.47,138.43 0 top
RELAY-5V  72.39,78.74 0 top
RESET-BUTTON  129.54,152.4 270 top
UP-BT  189.23,107.95 0 top
VALVE  134.62,74.93 0 top
VALVE-A1  195.58,19.05 0 top
VALVE-B  165.1,19.05 0 top
VALVE-C  134.62,19.05 0 top
VALVE-D  100.33,19.05 0 top
VALVE-E  64.77,19.05 0 top
VALVE-F  27.94,19.05 0 top
VALVES-GND  53.34,102.87 270 top
VALVES-SUPPLY  53.34,147.32 270 top

### Tracks (layer width: path | path; a pad name or v marks a point on that pad's centre or on a via)
5V-RELAY  (via drill 0.35)
  Top 1.016: v157.48,53.34 162.56,48.26 162.56,40.64 161.29,39.37 v151.13,39.37 | R10.2 203.33,52.2 v203.2,52.07 | v181.61,57.15 179.07,59.69 R7.2 173.99,59.56 173.99,53.34 v172.72,52.07 | R13.2 144.91,57.28 v140.97,53.34 133.35,53.34 OK3.4 | R19.2 74.93,58.29 v74.93,43.18 | v35.56,40.64 36.83,40.64 39.37,38.1 v40.64,38.1 | R16.2 110.62,54.74 v109.22,53.34 | R22.2 v35.56,50.8
  Top 2.54: v78.74,128.27 77.47,127 71.12,127 68.58,124.46 v68.58,115.57
  Bottom 1.016: v172.72,52.07 171.1,50.45 K1.A1 | OK1.4 v157.48,53.34 158.75,54.61 165.1,54.61 167.64,52.07 167.64,48.26 169.16,46.74 K1.A1 | v151.13,39.37 147.32,39.37 D2.C 146.05,41.31 K3.A1 | K2.A1 201.58,50.45 v203.2,52.07 200.66,54.61 190.5,54.61 OK2.4 v181.61,57.15 | D4.C 173.99,40.64 171.1,43.53 K1.A1 | K3.A1 134.52,40.64 D6.C 111.16,40.64 K4.A1 | K3.A1 140.97,47.09 v140.97,53.34 | K4.A1 104.39,46.74 OK4.4 D8.C v74.93,43.18 73.06,43.18 K5.A1 69.5,45.37 62.23,38.1 45.72,38.1 D10.C | K4.A1 109.22,50.9 v109.22,53.34 | D10.C 46.99,39.37 52.07,44.45 52.07,52.07 57.15,57.15 OK5.4 | 34.29,47.09 K6.A1 35.56,45.12 v35.56,40.64 | 34.29,47.09 34.29,49.53 31.75,52.07 27.94,52.07 OK6.4 21.59,57.15 17.78,53.34 17.78,45.72 12.7,40.64 D12.C | D10.C 41.91,39.37 | v35.56,50.8 35.56,48.36 34.29,47.09
  Bottom 1.245: REG-1.3 REG-2.3 80.01,129.54 v78.74,128.27
  Bottom 1.524: RELAY-5V.1 66.45,69.85 43.18,69.85 41.91,68.58 41.91,39.37 v40.64,38.1 41.91,38.1 41.91,11.43 154.94,11.43 154.94,35.56 v151.13,39.37
  Bottom 2.286: RELAY-5V.1 74.93,78.33 74.93,85.09 68.58,91.44 v68.58,115.57
12VDC  (via drill 0.35)
  Top 3.048: v152.4,15.24 160.02,15.24 v162.56,12.7
  Bottom 1.016: 58.42,133.35 VALVES-SUPPLY.8 | D1.A 72.39,137.16 73.66,135.89 REG-2.1 | D5.C 199.39,19.91 VALVE-A1.1 | 81.91,14.61 82.55,13.97
  Bottom 1.778: REG-2.1 REG-1.1 68.58,153.67 v66.04,156.21 58.42,156.21 | 52.07,184.15 55.06,187.14 12V-INPUT.1
  Bottom 2.032: 52.07,184.15 52.07,171.45 | D5.C 198.91,28.42 198.91,33.5 194.31,38.1 187.96,38.1 182.88,33.02 | 134.62,13.97 137.12,16.47 VALVE-C.1 139.7,21.18 D7.C
  Bottom 2.54: VALVES-SUPPLY.1 52.07,171.45 | 58.42,156.21 VALVES-SUPPLY.3 | 58.42,133.35 VALVES-SUPPLY.7 VALVES-SUPPLY.8 | v152.4,15.24 D7.C | VALVE-D.1 107.46,13.97 134.62,13.97 | D9.C 104.14,19.91 VALVE-D.1 | VALVE-D.1 98.2,13.97 82.55,13.97 | 81.91,14.61 D11.C 68.58,19.91 VALVE-E.1 | 38.1,22.86 D13.C 33.02,21.18 VALVE-F.1 | v162.56,12.7 163.83,13.97
  Bottom 3.048: 58.42,156.21 VALVES-SUPPLY.2 VALVES-SUPPLY.1 58.42,166.37 44.45,180.34 J1.PWR | VALVES-SUPPLY.3 VALVES-SUPPLY.4 VALVES-SUPPLY.5 VALVES-SUPPLY.6 VALVES-SUPPLY.7 | VALVES-SUPPLY.8 38.1,109.22 38.1,22.86 38.1,10.16 39.37,8.89 158.75,8.89 163.83,13.97 167.6,17.74 VALVE-B.1 170.18,21.18 D3.C 180.34,27.94 182.88,30.48 182.88,33.02
DB4  (via drill 0.35)
  Top 0.381: v140.97,146.05 142.24,144.78 148.59,144.78 149.2,145.39 IC1.13
  Bottom 0.889: LCD1.11 115.06,138.43 132.08,138.43 139.7,146.05 v140.97,146.05
DB5  (via drill 0.35)
  Top 0.381: v140.97,143.51 142.76,143.51 143.29,144.04 149.12,144.04 150,144.92 IC1.14
  Bottom 0.889: LCD1.12 115.06,135.89 132.08,135.89 139.7,143.51 v140.97,143.51
DB6  (via drill 0.35)
  Top 0.381: IC1.15 150.8,144.45 148.59,142.24 142.24,142.24 v140.97,140.97
  Bottom 0.889: LCD1.13 115.06,133.35 132.08,133.35 139.7,140.97 v140.97,140.97
DB7  (via drill 0.35)
  Top 0.381: v143.51,140.97 149.86,140.97 149.86,142.24 151.6,143.98 IC1.16
  Bottom 0.889: LCD1.14 115.06,130.81 133.35,130.81 v143.51,140.97
DOWN-BUTTON  (via drill 0.35)
  Top 0.635: v158.75,158.75 158.1,158.1 IC1.34
  Bottom 0.635: DOWN-BT.1 197.41,149.3 187.96,158.75 v158.75,158.75
E  (via drill 0.35)
  Top 0.381: IC1.12 142.86,146.7 v142.24,147.32
  Bottom 0.889: 113.03,140.97 104.14,132.08 96.01,132.08 94.74,130.81
  Bottom 1.016: LCD1.6 94.74,130.81 | v142.24,147.32 138.81,147.32 132.46,140.97 113.03,140.97
ENTER-BUTTON  (via drill 0.35)
  Top 0.381: v170.18,149.86 168.91,151.13 168.91,163.83 156.21,163.83 154,161.62 IC1.37
  Bottom 0.635: ENTER-BT.1 168.48,121.92 170.18,121.92 175.26,127 175.26,144.78 v170.18,149.86
GND  (via drill 0.35)
  Top 0.381: 154.94,152.4 IC1.6 146.52,152.22 145.81,152.22 144.72,151.13 v142.24,151.13 | IC1.28 157.92,152.22 157.21,152.22 154.85,149.86 153.67,149.86 153.2,149.39 IC1.18 | IC1.28 154.94,152.4 | 154.94,152.4 v152.4,154.94 | v160.02,152.4 IC1.28 | v149.86,154.94 151.13,156.21 151.65,156.21 152.4,156.96 IC1.39 152.4,161.29 152.53,161.42 R4.2
  Top 1.016: v96.52,152.4 106.68,152.4 110.49,156.21 110.49,161.29 113.16,163.96 R1.1 119.38,165.1 120.65,163.83 120.65,161.29 v121.92,160.02 | v109.22,177.8 109.18,177.76 CHIP-REGULATOR.3 | 157.48,43.13 152.38,48.23 Q1.2 148,44.45 | K3.COM 127,48.74 | 88.85,44.45 85.06,48.23 Q4.2 84.77,44.13 | 104.38,43.42 104.62,43.18
  Top 1.143: R6.2 90.17,116.84 v87.63,119.38 82.55,114.3 v81.28,114.3
  Top 1.27: v96.52,152.4 96.52,156.21 94.02,158.71 PWR-CHK-REG.3
  Top 1.778: v87.63,179.07 93.94,179.07 CHIP-REGULATOR.3
  Top 2.032: Q6.2 20.27,43.18 v26.67,43.18 27.94,44.45 47,44.45 50.48,47.93 Q5.2 50.7,48.53 54.65,44.58 59.56,44.58 v60.96,43.18 68.58,43.18 72.39,39.37 73.66,39.37 76.2,36.83 81.28,36.83 84.77,40.32 84.77,44.13 85.06,44.42 85.06,48.23 | Q4.2 88.85,44.45 v96.52,44.45 | K4.COM 104.38,43.42 | 104.62,43.18 118.11,43.18 120.54,45.61 120.54,48.74 | Q3.2 120.54,48.74 | 120.54,48.74 127,48.74 127.57,48.74 127.73,48.9 129.51,48.9 129.67,48.74 K3.COM 138.91,44.45 148,44.45 148.6,44.45 151.75,47.6 151.75,47.61 152.38,48.23 | Q1.2 157.48,43.13 157.48,41.91 v160.02,41.91 | v191.53,44.69 190.58,44.69 190.47,44.58 186.51,44.58 Q2.2
  Bottom 0.381: v152.4,154.94 v149.86,154.94
  Bottom 1.016: 76.2,158.75 73.66,161.29 | ENTER-BT.3 157.26,105.19 159.59,102.87 165.38,102.87 NEXT-BT.3 171.02,102.87 184.15,102.87 186.69,105.41 186.41,105.69 UP-BT.3 188.8,102.87 194.59,102.87 DOWN-BT.3 | ENTER-BT.3 156.77,80.57 COMMON-GND.1 | ENTER-BT.3 153.67,108.79 153.67,111.76 166.37,124.46 166.37,146.05 v160.02,152.4 | 74.04,122.81 LCD1.1 | ISP-HEADER.6 v121.92,160.02 128.27,160.02 | 128.27,160.02 131.8,156.49 RESET-BUTTON.1 | 128.27,160.02 133.35,160.02 v142.24,151.13 | R3.A 113.03,173.99 v109.22,177.8 | 152.4,62.23 149.86,62.23 148.59,60.96 148.59,59.69 | v96.52,44.45 96.52,46.2 K4.COM | v60.96,43.18 60.96,46.2 K5.COM | v26.67,43.18 26.67,47.47 K6.COM
  Bottom 1.143: R3.A 110.49,170.18 102.87,170.18 96.52,163.83 v96.52,152.4 | LCD1.10 LCD1.9 LCD1.8 LCD1.7 89.92,120.4 88.9,119.38 v87.63,119.38 84.84,122.17 LCD1.5 | LCD1.1 74.93,123.2 74.93,118.11 78.74,114.3 v81.28,114.3
  Bottom 1.245: 76.2,158.75 77.47,157.48 83.82,157.48 88.9,152.4 v96.52,152.4
  Bottom 1.27: DEBUG.4 149.86,173.99 147.32,176.53 130.81,176.53 121.92,185.42 86.77,185.42 5V-INP.2
  Bottom 1.524: 73.66,161.29 77.47,157.48
  Bottom 1.778: LCD1.1 74.68,128.02 | REG-1.2 77.47,157.48 | 73.66,161.29 69.85,161.29 68.58,162.56 68.58,180.34 74.15,180.34 | J1.GND 18.53,190.97 74.15,190.97 74.15,184.07 | C1.2 74.15,178.6 74.15,180.34 | 12V-INPUT.2 74.15,184.07 | 74.15,184.07 74.15,180.34 | 5V-INP.2 85.05,181.65 v87.63,179.07
  Bottom 2.032: REG-1.2 REG-2.2 | v160.02,41.91 160.02,43.66 K1.COM | K1.COM 165.1,45.72 172.72,38.1 177.8,38.1 180.34,40.64 186.69,40.64 186.84,40.79 187.63,40.79 v191.53,44.69 K2.COM | K1.COM 165.1,50.8 164.47,51.44 155.57,51.44 148.59,58.42 148.59,59.69 148.59,62.23 152.4,62.23 156.21,66.04 COMMON-GND.1 | COMMON-GND.1 COMMON-GND.2 COMMON-GND.3 COMMON-GND.4 COMMON-GND.5 COMMON-GND.6 | COMMON-GND.1 156.21,92.71 | 156.21,92.71 156.21,104.14 157.26,105.19 | 74.15,190.97 172.25,190.97 207.01,156.21 207.01,99.06 200.66,92.71 156.21,92.71
  Bottom 2.54: 74.04,122.81 60.58,122.81 VALVES-GND.1 VALVES-GND.2 VALVES-GND.3 VALVES-GND.4 VALVES-GND.5 VALVES-GND.6 VALVES-GND.7 VALVES-GND.8 65.22,78.29 RELAY-5V.2 | REG-2.2 77.47,130.81 74.68,128.02
  pour Top (isolate 1.016): 207.01,193.04 41.91,193.04 35.56,186.69 35.56,120.65 2.54,87.63 2.54,34.29 17.78,19.05 17.78,12.7 27.94,2.54 191.77,2.54 210.82,21.59 210.82,189.23
  pour Bottom (isolate 1.016): 35.56,186.69 35.56,120.65 2.54,87.63 2.54,34.29 17.78,19.05 17.78,12.7 27.94,2.54 191.77,2.54 210.82,21.59 210.82,189.23 207.01,193.04 41.91,193.04
MISO  (via drill 0.35)
  Top 0.381: IC1.2 144.12,155.6 142.24,157.48
  Top 0.635: 142.24,157.48 140.97,158.75 124.46,158.75 124.46,157.48 123.19,156.21 119.38,156.21 116.84,153.67 v114.3,153.67
  Bottom 0.635: ISP-HEADER.1 113.03,154.94 v114.3,153.67
MOSI  (via drill 0.35)
  Top 0.381: v142.24,160.02 143.08,160.02 IC1.1
  Bottom 1.016: ISP-HEADER.4 115.57,162.56 139.7,162.56 v142.24,160.02
N$1  (via drill 0.35)
  Top 1.143: R6.1 106.81,119.38 v115.57,119.38
  Bottom 1.143: LCD1.16 115.57,120.66 v115.57,119.38
N$2
  Top 0.381: PWR-LED.C R1.2
N$3  (via drill 0.35)
  Top 1.016: R7.1 170.18,59.69 v167.64,57.15
  Bottom 1.016: OK1.1 v167.64,57.15
N$4
  Top 0.381: BACKUP-LED.A 148.82,162.33 149.86,161.29 149.86,159.75 150.62,158.99 150.62,158.28 IC1.41
N$5
  Top 0.381: BACKUP-LED.C 148.82,163.83 R4.1
N$6
  Bottom 1.143: LCD1.3 79.76,125.48 102.87,148.59 102.87,157.48 107.95,162.56 107.95,166.37 109.22,167.64 115.57,167.64 116.84,168.91 R3.S
N$7  (via drill 0.35)
  Top 1.016: LED1.A 165.1,62.46 v165.1,62.23
  Bottom 1.016: v165.1,62.23 OK1.2
N$8  (via drill 0.35)
  Top 1.016: v152.4,59.69 149.86,57.15 147.32,57.15 145.92,55.75 R5.1
  Bottom 1.016: OK1.3 v152.4,59.69
N$9  (via drill 0.35)
  Top 0.508: 155.11,50.63 153.67,52.07 v151.13,52.07 Q1.3
  Top 1.016: v156.21,49.53 155.11,50.63
  Bottom 0.508: D2.A 147.32,52.07 v151.13,52.07
  Bottom 1.016: v156.21,49.53 156.31,49.53 K1.A2
N$10
  Top 1.016: R5.2 148.72,49.99 Q1.1
N$11  (via drill 0.35)
  Top 1.016: v198.12,57.15 R10.1
  Bottom 1.016: OK2.1 v198.12,57.15
N$12
  Bottom 3.048: VALVE-B.2 160.02,21.18 D3.A 159.1,28.86 K1.NO
N$13  (via drill 0.35)
  Top 1.016: LED2.A 195.58,62.46 v195.58,62.23
  Bottom 1.016: v195.58,62.23 OK2.2
N$14  (via drill 0.35)
  Top 1.016: v175.26,55.88 176.4,54.74 R9.1
  Bottom 1.016: v175.26,55.88 176.53,55.88 180.34,59.69 OK2.3
N$15
  Top 1.016: R9.2 179.2,49.99 Q2.1
N$16  (via drill 0.35)
  Top 1.016: Q2.3 183.05,52.07 184.15,52.07 | 184.15,52.07 185.42,52.07 v187.96,49.53 | v181.61,53.34 182.88,53.34 184.15,52.07
  Bottom 1.016: v187.96,49.53 189.58,47.91 K2.A2 | D4.A 179.07,50.8 v181.61,53.34
N$17
  Bottom 1.016: 189.58,28.29 D5.A | 189.66,22.02 189.23,22.45
  Bottom 3.048: K2.NO 189.58,28.29 | D5.A 189.23,22.45 | VALVE-A1.2 189.66,22.02
N$18  (via drill 0.35)
  Top 1.016: R13.1 142.11,59.56 v139.7,57.15
  Bottom 1.016: OK3.1 v139.7,57.15
N$19  (via drill 0.35)
  Top 1.016: LED3.A 137.16,62.46 v137.16,62.23
  Bottom 1.016: v137.16,62.23 OK3.2
N$20  (via drill 0.35)
  Top 1.016: R12.1 120.52,59.69 v121.92,59.69
  Bottom 1.016: v121.92,59.69 OK3.3
N$21
  Top 1.016: R12.2 116.97,50.93 116.84,50.8 116.84,50.12 Q3.1
N$22  (via drill 0.35)
  Top 1.016: v119.38,52.07 Q3.3
  Bottom 1.016: K3.A2 118.36,46.74 D6.A 118.11,50.8 v119.38,52.07
N$23
  Bottom 1.016: K3.NO 128.62,28.86 D7.A 129.54,21.18 VALVE-C.2
N$24  (via drill 0.35)
  Top 1.016: v104.14,57.15 R16.1
  Bottom 1.016: OK4.1 v104.14,57.15
N$25  (via drill 0.35)
  Top 1.016: LED4.A 101.6,62.46 v101.6,62.23
  Bottom 1.016: v101.6,62.23 OK4.2
N$26  (via drill 0.35)
  Top 1.016: v81.28,58.42 77.34,54.48 R15.1
  Bottom 1.016: OK4.3 92.76,58.47 92.11,58.47 92.06,58.42 v81.28,58.42
N$27
  Top 1.016: R15.2 81.28,52.2 81.28,49.53 82.28,48.53 Q4.1
N$28  (via drill 0.35)
  Top 1.016: v88.9,48.26 86.53,50.63 Q4.3 83.82,50.8 v82.55,52.07
  Bottom 1.016: v88.9,48.26 91.54,48.26 K4.A2 | v82.55,52.07 81.28,50.8 D8.A
N$29
  Bottom 2.54: VALVE-D.2 97.83,24.09 D9.A 93.98,33.62 K4.NO
N$30  (via drill 0.35)
  Top 1.016: R19.1 69.85,58.42 v68.58,57.15
  Bottom 1.016: OK5.1 v68.58,57.15
N$31  (via drill 0.35)
  Top 1.016: LED5.A 66.04,62.46 v66.04,62.23
  Bottom 1.016: v66.04,62.23 OK5.2
N$32  (via drill 0.35)
  Top 1.016: v45.72,59.69 43.05,57.02 R18.1
  Bottom 1.016: OK5.3 v45.72,59.69
N$33
  Top 1.016: R18.2 46.99,52.2 46.99,48.26 48.31,48.26 Q5.1
N$34  (via drill 0.35)
  Top 1.016: v48.26,52.07 49.53,50.8 Q5.3 50.97,50.63 v54.61,46.99
  Bottom 1.016: D10.A 45.72,49.53 v48.26,52.07 | v54.61,46.99 57.25,46.99 K5.A2
N$35
  Bottom 2.54: VALVE-E.2 58.42,22.45 D11.A 58.42,33.62 K5.NO
N$36  (via drill 0.35)
  Top 1.016: v33.02,57.15 34.42,57.15 R22.1
  Bottom 1.016: OK6.1 v33.02,57.15
N$37  (via drill 0.35)
  Top 1.016: LED6.A 30.48,62.46 v30.48,62.23
  Bottom 1.016: v30.48,62.23 OK6.2
N$38  (via drill 0.35)
  Top 1.016: v8.89,57.15 7.49,55.75 R21.1
  Bottom 1.016: v8.89,57.15 11.43,59.69 OK6.3
N$39
  Top 1.016: R21.2 10.16,53.21 10.16,49.53 11.16,48.53 Q6.1
N$40  (via drill 0.35)
  Top 1.016: v12.7,52.07 13.97,50.8 Q6.3 20.49,50.63 v21.59,49.53
  Bottom 1.016: D12.A 11.43,50.8 v12.7,52.07 | v21.59,49.53 21.94,49.18 K6.A2
N$41
  Bottom 2.54: VALVE-F.2 22.86,21.18 D13.A 22.86,33.62 K6.NO
NEXT-BUTTON  (via drill 0.35)
  Top 0.381: v167.64,153.67 166.37,153.67 165.1,154.94 165.1,162.56 156.21,162.56 154.8,161.15 IC1.36
  Bottom 0.635: NEXT-BT.1 168.2,113.59 171.45,116.84 180.34,116.84 180.34,143.51 170.18,153.67 v167.64,153.67
POWER-CHECK  (via drill 0.35)
  Top 0.508: PWR-CHK-REG.2 94,151.13 135.89,151.13 137.16,152.4 v137.16,153.67 | IC1.40 151.48,157.98 151.48,157.18 151.24,156.94 150.44,156.94 149.71,156.21 148.59,156.21 143.51,161.29 139.7,161.29 v138.43,160.02
  Bottom 0.508: v137.16,153.67 138.41,153.67 141.86,150.22 142.62,150.22 143.15,150.75 143.15,151.51 138.43,156.23 v138.43,160.02
PROT-12V  (via drill 0.35)
  Top 1.016: v86.36,147.32 89.16,150.12 PWR-CHK-REG.1 88.62,151.41 86.36,153.67 86.36,162.11 87.57,163.32 87.57,165.06 CHIP-REGULATOR.1
  Bottom 1.016: D1.C v86.36,147.32
RS  (via drill 0.35)
  Top 0.381: v142.24,148.59 145.8,148.59 145.81,148.58 146.52,148.58 IC1.11
  Bottom 0.889: v142.24,148.59 135.89,148.59 130.81,143.51 111.76,143.51 110.49,142.24 | 102.87,134.62 93.47,134.62
  Bottom 1.016: 93.47,134.62 LCD1.4 | 110.49,142.24 102.87,134.62
RST  (via drill 0.35)
  Top 0.254: 139.7,153.67 v138.43,152.4
  Top 0.381: R2.2 132.08,170.05 132.08,165.1 130.81,163.83 125.73,163.83 123.19,161.29 123.19,158.75 v121.92,157.48 | IC1.4 145.72,154 145.45,154.27 140.3,154.27 139.7,153.67
  Bottom 0.635: RESET-BUTTON.3 130.53,152.4 v138.43,152.4
  Bottom 1.016: ISP-HEADER.5 120.65,154.94 126.57,154.94 RESET-BUTTON.3 125.45,157.48 v121.92,157.48
RXD  (via drill 0.35)
  Top 0.508: IC1.9 148.73,150 v149.86,151.13
  Bottom 0.508: v149.86,151.13 148.59,152.4 148.59,156.21 144.78,160.02 DEBUG.2
SCK  (via drill 0.35)
  Top 0.381: IC1.3 135.75,154.8 134.62,153.67 v119.38,153.67
  Bottom 0.635: ISP-HEADER.3 115.57,156.21 118.11,153.67 v119.38,153.67
TXD  (via drill 0.35)
  Top 0.508: IC1.10 150.47,149.2 v152.4,151.13
  Bottom 0.508: DEBUG.3 147.32,168.91 148.59,167.64 153.67,167.64 156.21,165.1 156.21,154.94 v152.4,151.13
UP-BUTTON  (via drill 0.35)
  Top 0.381: v163.83,156.21 162.56,157.48 162.56,161.29 157.48,161.29 155.6,159.41 IC1.35
  Bottom 0.635: UP-BT.1 185.98,148.03 177.8,156.21 v163.83,156.21
VAL-A  (via drill 0.35)
  Top 0.381: v161.29,138.43 161.29,148.59 160.68,149.2 IC1.24
  Top 1.016: v153.67,68.58 186.46,68.58 LED2.C
  Bottom 1.016: v161.29,138.43 162.56,137.16 162.56,127 153.67,118.11 149.86,118.11 147.32,115.57 VALVE.6 147.32,71.12 149.86,68.58 v153.67,68.58
VAL-B  (via drill 0.35)
  Top 0.381: IC1.23 158.94,148.4 160.02,147.32 v160.02,135.89
  Top 1.016: v147.32,64.77 LED1.C
  Bottom 1.016: v160.02,135.89 160.02,128.27 152.4,120.65 149.86,120.65 142.24,113.03 VALVE.5 142.24,69.85 v147.32,64.77
VAL-C  (via drill 0.35)
  Top 0.381: IC1.22 156.4,133.54 v156.21,133.35
  Top 1.016: v132.08,68.58 132.08,65 LED3.C
  Bottom 1.016: v156.21,133.35 156.21,128.27 151.13,123.19 147.32,123.19 137.16,113.03 VALVE.4 137.16,68.58 v132.08,68.58
VAL-D  (via drill 0.35)
  Top 0.381: IC1.21 155.6,134.01 v153.67,132.08
  Top 1.016: v96.52,67.31 96.52,65 LED4.C
  Bottom 1.016: v153.67,132.08 153.67,129.54 149.86,125.73 144.78,125.73 132.08,113.03 VALVE.3 132.08,74.93 124.46,67.31 v96.52,67.31
VAL-E  (via drill 0.35)
  Top 0.381: IC1.20 154.8,143.37 152.4,140.97 152.4,132.08 v151.13,130.81
  Top 1.016: v60.96,67.31 60.96,65 LED5.C
  Bottom 1.016: v151.13,130.81 149.86,129.54 144.78,129.54 127,111.76 VALVE.2 127,77.47 119.38,69.85 72.39,69.85 69.85,67.31 v60.96,67.31
VAL-F  (via drill 0.35)
  Top 0.381: IC1.19 154,145.11 151.13,142.24 151.13,133.35 v149.86,132.08
  Top 1.016: v78.74,74.93 77.47,73.66 34.06,73.66 LED6.C
  Bottom 1.016: v149.86,132.08 143.51,132.08 121.92,110.49 VALVE.1 116.84,74.93 v78.74,74.93
VCC  (via drill 0.35)
  Top 0.381: IC1.5 149.39,153.2 153.2,157.01 IC1.38 153.38,157.92 153.38,157.21 157.21,153.38 157.92,153.38 IC1.29 160.49,153.2 161.29,152.4 160.49,151.6 IC1.27 157.92,151.42 157.21,151.42 156.21,150.42 156.21,148.59 v154.94,148.59 | IC1.17 152.22,146.88 152.22,147.59 152.02,147.79 151.93,147.79 v151.13,148.59 | PWR-LED.A 106.45,168.91 128.14,168.91 R2.1
  Top 0.635: IC1.5 141.77,153.2 138.43,149.86 134.62,149.86 130.81,146.05 v115.57,146.05
  Top 0.889: v124.46,128.27 115.57,137.16 v115.57,146.05
  Top 1.143: v106.68,158.75 105.41,158.75 102.87,161.29 102.87,164.87 PWR-LED.A 102.64,165.35 CHIP-REGULATOR.2 93.44,166.37 v92.71,166.37
  Bottom 0.381: v151.13,148.59 v154.94,148.59
  Bottom 0.889: ISP-HEADER.2 107.95,160.02 v106.68,158.75 106.68,153.67 114.3,146.05 v115.57,146.05
  Bottom 1.016: 5V-SUPPLY.1 5V-SUPPLY.2 5V-SUPPLY.3 5V-SUPPLY.4 5V-SUPPLY.5 5V-SUPPLY.6 113.03,106.68 124.46,118.11 | 124.46,118.11 v124.46,128.27 | 124.46,118.11 120.65,118.11 118.11,115.57 111.76,115.57 110.49,116.84 110.49,123.2 LCD1.15 110.24,117.86 105.41,113.03 87.64,113.03 LCD1.2
  Bottom 1.143: v92.71,166.37 90.17,166.37 85.09,171.45 85.09,175.26 81.28,179.07 | 83.82,179.07 90.17,172.72 105.41,172.72 106.68,173.99 106.68,180.34 109.22,182.88 119.38,182.88 121.92,180.34 121.92,175.26 120.65,173.99 R3.E
  Bottom 1.27: 83.82,179.07 81.28,179.07 78.72,179.07 C1.1 77.45,184.54 5V-INP.1 | DEBUG.1 139.7,173.99 R3.E

### Text on the board
tPlace: + 12V - | + 5V - | Timer based Valve-controller Board | 12V-jack | (This side updwards) | VCC RX TX GND | VCC MOSI GND | AVR ATMEGA32 | MISO SCK RST | 12V for Valves | ENTER | NEXT/BACK | UP | DOWN | GND for Valves | Control | VALVE-F | VALVE-E | VALVE-D | VALVE-C | VALVE-B | VALVE-A
bPlace: + -